# EAGLE design STM32breakout&PowerDistributionIteration4 (EAGLE 9.6.2)
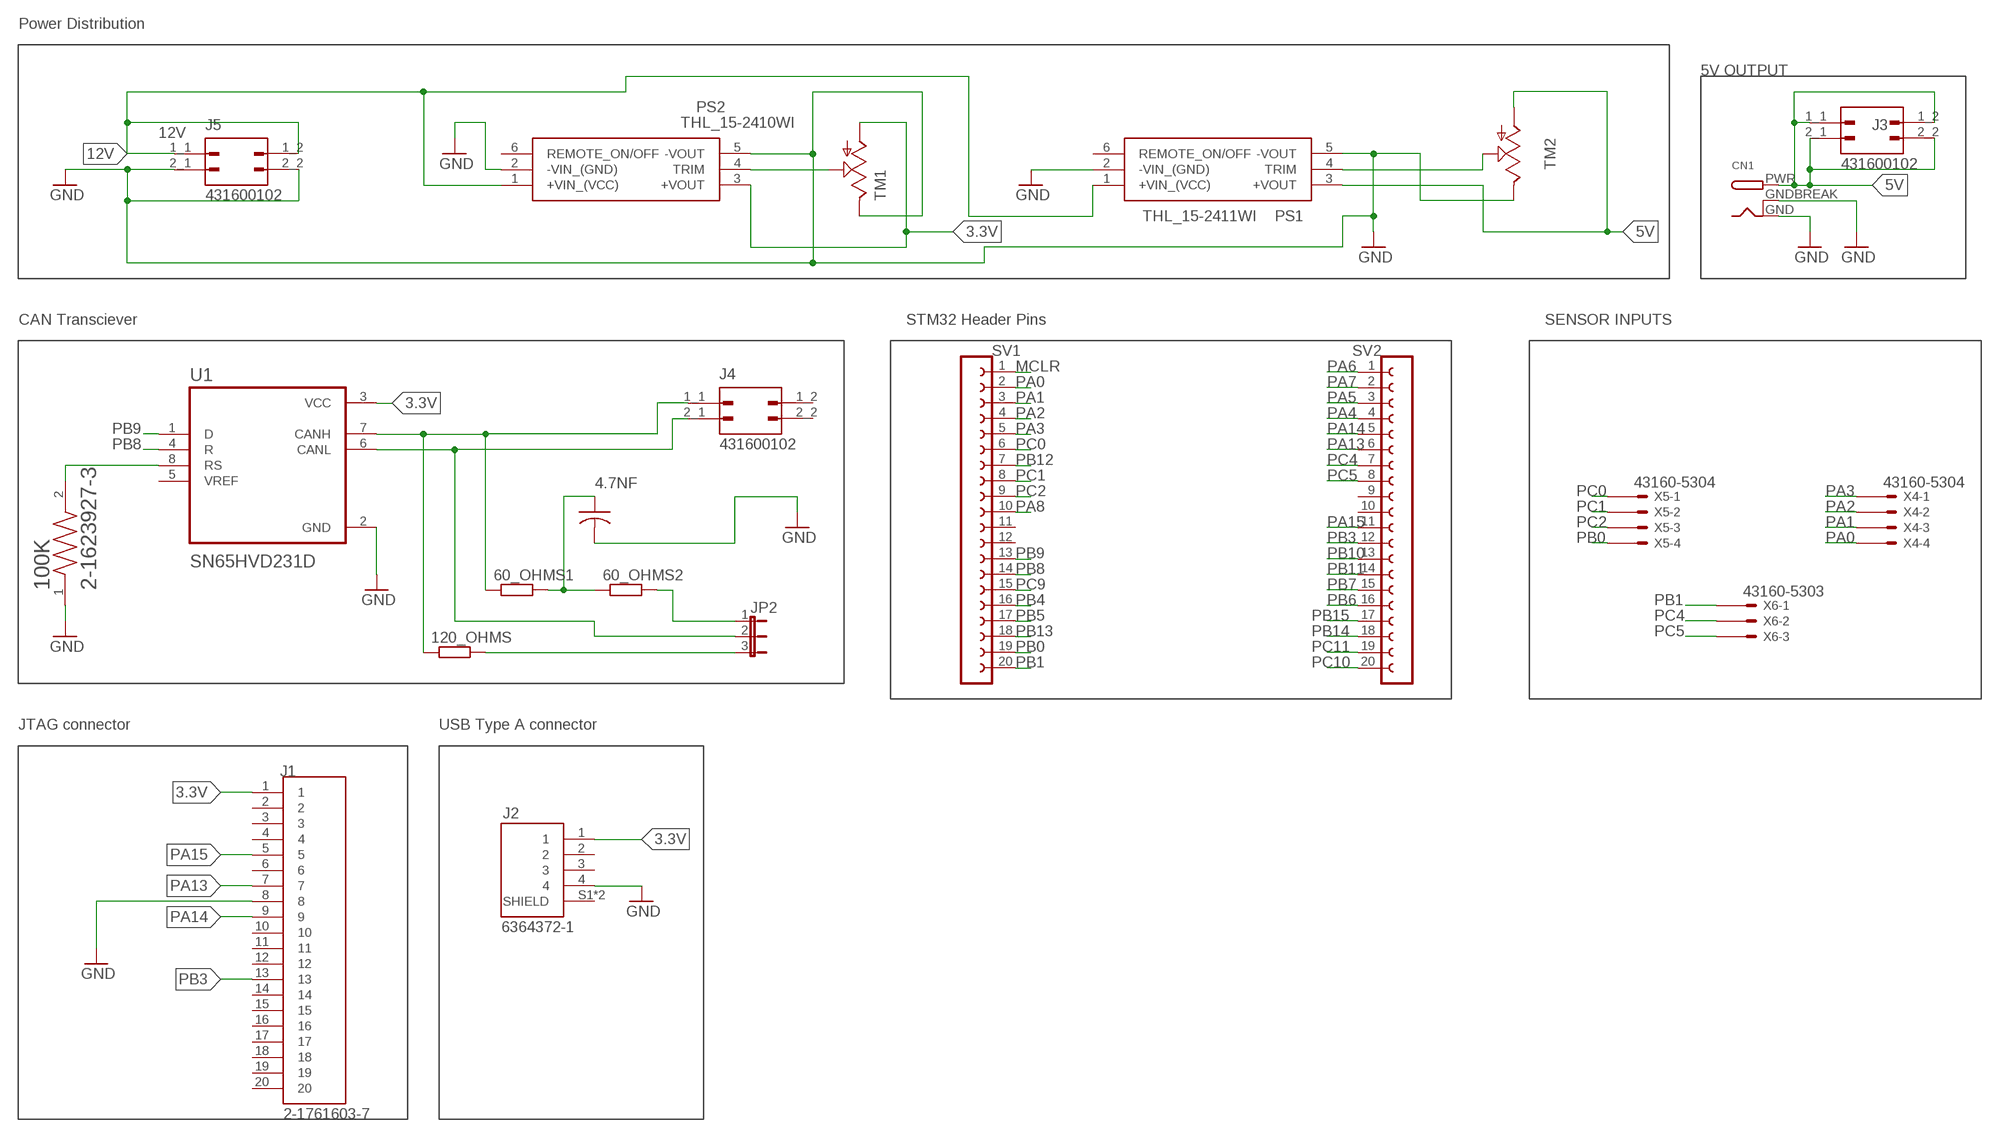
[diagram p0: schematic, sheet 1]

## Parts
4.7NF  C-US025-030X050  [C025-030X050]
60_OHMS1  R-EU_0204/7  [0204/7]
60_OHMS2  R-EU_0204/7  [0204/7]
100K  2-1623927-3  [RESAD700W45L350D185]
120_OHMS  R-EU_0204/7  [0204/7]
CN1  DCBARRELPTH  [DCJACK_2MM_PTH]
J1  2-1761603-7  [TE_2-1761603-7]
J2  6364372-1  [TE_6364372-1]
J3  431600102  [MOLEX_431600102]
J4  431600102  [MOLEX_431600102]
J5  431600102  [MOLEX_431600102]
JP2  JP2W  [JP2W]
PS1  THL_15-2411WI  [THL152411WI]
PS2  THL_15-2410WI  [THL152410WI]
SV1  FE20-1  [FE20]
SV2  FE20-1  [FE20]
TM1  TRIM  [6MM]
TM2  TRIM  [6MM]
U1  SN65HVD231D  [SOIC127P599X175-8N]
X4  43160-5304  [43160-XX04]
X5  43160-5304  [43160-XX04]
X6  43160-5303  [43160-XX03]

## Nets
3.3V: J1.1 J2.1 PS2.3(+VOUT) TM1.A U1.3(VCC)
5V: CN1.PWR J3.1_1 J3.1_2 J3.2_1 J3.2_2 PS1.3(+VOUT) TM2.A
12V: J5.1_1 J5.1_2 PS1.1(+VIN_(VCC)) PS2.1(+VIN_(VCC))
GND: 4.7NF.2 100K.1 CN1.GND CN1.GNDBREAK J1.8 J2.4 J5.2_1 J5.2_2 PS1.2(-VIN_(GND)) PS1.5(-VOUT) PS2.2(-VIN_(GND)) PS2.5(-VOUT) TM1.E TM2.E U1.2(GND)
MCLR: SV1.1
N$1: PS2.4(TRIM) TM1.S
N$3: 100K.2 U1.8(RS)
N$4: 120_OHMS.2 JP2.3
N$5: 60_OHMS2.2 JP2.1
N$6: 4.7NF.1 60_OHMS1.2 60_OHMS2.1
N$8: PS1.4(TRIM) TM2.S
PA0: SV1.2 X4.4@1(-4:S)
PA1: SV1.3 X4.3@1(-3:S)
PA2: SV1.4 X4.2@1(-2:S)
PA3: SV1.5 X4.1@1(-1:S)
PA4: SV2.4
PA5: SV2.3
PA6: SV2.1
PA7: SV2.2
PA8: SV1.10
PA13: J1.7 SV2.6
PA14: J1.9 SV2.5
PA15: J1.5 SV2.11
PB0: SV1.19 X5.4@1(-4:S)
PB1: SV1.20 X6.1@1(-1:S)
PB3: J1.13 SV2.12
PB4: SV1.16
PB5: SV1.17
PB6: SV2.16
PB7: SV2.15
PB8 [Differential Signals]: SV1.14 U1.4(R)
PB9 [Differential Signals]: SV1.13 U1.1(D)
PB10: SV2.13
PB11: SV2.14
PB12: SV1.7
PB13: SV1.18
PB14: SV2.18
PB15: SV2.17
PC0: SV1.6 X5.1@1(-1:S)
PC1: SV1.8 X5.2@1(-2:S)
PC2: SV1.9 X5.3@1(-3:S)
PC4: SV2.7 X6.2@1(-2:S)
PC5: SV2.8 X6.3@1(-3:S)
PC9: SV1.15
PC10: SV2.20
PC11: SV2.19
SIG_N [Differential Signals]: J4.2_1 JP2.2 U1.6(CANL)
SIG_P [Differential Signals]: 60_OHMS1.1 120_OHMS.1 J4.1_1 U1.7(CANH)
Unconnected: J1.2 J1.3 J1.4 J1.6 J1.10 J1.11 J1.12 J1.14 J1.15 J1.16 J1.17 J1.18 J1.19 J1.20 J2.2 J2.3 J2.S1(SHIELD) J2.S2(SHIELD) J4.1_2 J4.2_2 PS1.6(REMOTE_ON/OFF) PS2.6(REMOTE_ON/OFF) SV1.11 SV1.12 SV2.9 SV2.10 U1.5(VREF) X4.1@2(-1:S) X4.2@2(-2:S) X4.3@2(-3:S) X4.4@2(-4:S) X5.1@2(-1:S) X5.2@2(-2:S) X5.3@2(-3:S) X5.4@2(-4:S) X6.1@2(-1:S) X6.2@2(-2:S) X6.3@2(-3:S)

## Notes on the sheet
- Power Distribution
- 5V OUTPUT
- CAN Transciever | STM32 Header Pins | SENSOR INPUTS
- JTAG connector | USB Type A connector

## Library data of the parts
4.7NF = adafruit:C-US: CAPACITOR, American symbol
60_OHMS1 60_OHMS2 120_OHMS = rcl:R-EU_: RESISTOR, European symbol; SPICEPREFIX: R
100K = 2-1623927-3:2-1623927-3: CFR16 5% 10K Check availability <https://pricing.snapeda.com/parts/2-1623927-3/TE%20Connectivity/view-part?ref=eda>; AVAILABILITY: In Stock; COMMENT: 2-1623927-3; DESCRIPTION: Carbon Film Resistors - Through Hole 1K Ohm 5% 1/4W Res Carbon Film; EU_ROHS_COMPLIANCE: Compliant; MF: TE Connectivity; MP: 2-1623927-3; PACKAGE: None; PRICE: None; PURCHASE-URL: https://pricing.snapeda.com/search/part/2-1623927-3/?ref=eda
CN1 = adafruit:DCBARREL: 2.0mm DC Barrel Jack DCJACK_2MM_PTH - Through Hole Jack (4UConnector: 05537)
J1 = 2-1761603-7:2-1761603-7: IDC LOW PRO HDR 20P VERT BLACK Check availability <https://pricing.snapeda.com/parts/2-1761603-7/TE%20Connectivity/view-part?ref=eda>; AVAILABILITY: In Stock; COMMENT: 2-1761603-7; DESCRIPTION: AMP-LATCH 20 Position 2.54 mm Dual Row Through-Hole Straight Pin Header; EU_ROHS_COMPLIANCE: Compliant; MF: TE Connectivity; MP: 2-1761603-7; PACKAGE: None; PRICE: None; PURCHASE-URL: https://pricing.snapeda.com/search/part/2-1761603-7/?ref=eda
J2 = 6364372-1:6364372-1: CONN RCPT USB TYPE A PCB R/A Check availability <https://pricing.snapeda.com/parts/6364372-1/TE%20Connectivity/view-part?ref=eda>; AVAILABILITY: In Stock; CENTERLINE_PITCH: 2 mm[.078 in]; COMMENT: 6364372-1; DESCRIPTION: Conn USB RCP 4 POS Solder RA Thru-Hole 4 Terminal 1 Port Box; EU_ROHS_COMPLIANCE: Compliant; MF: TE Connectivity; MP: 6364372-1; NUMBER_OF_POSITIONS: 4; PACKAGE: None; PRICE: None; PRODUCT_TYPE: Connector; PURCHASE-URL: https://pricing.snapeda.com/search/part/6364372-1/?ref=eda
J3-J5 = 431600102:431600102: Check availability <https://pricing.snapeda.com/parts/43160-0102/Molex/view-part?ref=eda>; AVAILABILITY: In Stock; DESCRIPTION: 2 Position Header, Male Blades Connector Solder 0.295 (7.50mm) Through Hole; MF: Molex; MP: 43160-0102; PACKAGE: None; PRICE: None; PURCHASE-URL: https://pricing.snapeda.com/search/part/43160-0102/?ref=eda
JP2 = jumper:JP2W: JUMPER
PS1 = SamacSys_Parts:THL_15-2411WI: 15 Watt DC/DC converter, industrial, 4:1 input, cost efficient design, encapsulated, 1" x 1" metal package Source: Datasheet <https://tracopower.com/thl15wi-datasheet/>; DESCRIPTION: 15 Watt DC/DC converter, industrial, 4:1 input, cost efficient design, encapsulated, 1" x 1" metal package; HEIGHT: 10.66mm; MANUFACTURER_NAME: Traco Power; MANUFACTURER_PART_NUMBER: THL 15-2411WI; MOUSER_PART_NUMBER: 495-THL15-2411WI; MOUSER_PRICE-STOCK: https://www.mouser.co.uk/ProductDetail/TRACO-Power/THL-15-2411WI?qs=vLWxofP3U2zTxW0y6%2FAPOg%3D%3D
PS2 = SamacSys_Parts:THL_15-2410WI: 15 Watt DC/DC converter, industrial, 4:1 input, cost efficient design, encapsulated, 1" x 1" metal package Source: Datasheet <https://tracopower.com/thl15wi-datasheet/>; DESCRIPTION: 15 Watt DC/DC converter, industrial, 4:1 input, cost efficient design, encapsulated, 1" x 1" metal package; HEIGHT: 10.66mm; MANUFACTURER_NAME: Traco Power; MANUFACTURER_PART_NUMBER: THL 15-2410WI; MOUSER_PART_NUMBER: 495-THL15-2410WI; MOUSER_PRICE-STOCK: https://www.mouser.co.uk/ProductDetail/TRACO-Power/THL-15-2410WI/?qs=vLWxofP3U2zUD2qGlvCiuw%3D%3D
SV1 SV2 = con-lsta:FE20-1: FEMALE HEADER; OC_FARNELL: unknown; OC_NEWARK: unknown
TM1 TM2 = adafruit:TRIM
U1 = SN65HVD231D:SN65HVD231D: Check availability <https://pricing.snapeda.com/parts/SN65HVD231D/Texas%20Instruments/view-part?ref=eda>; AVAILABILITY: In Stock; DESCRIPTION: 3.3V CAN Transceiver with Sleep Mode 8-SOIC -40 to 85; MF: Texas Instruments; MP: SN65HVD231D; PACKAGE: SOIC-8 Texas Instruments; PRICE: None; PURCHASE-URL: https://pricing.snapeda.com/search/part/SN65HVD231D/?ref=eda
X4 X5 = con-molex:43160-*04: SDA-43160 Connector Source: http://www.molex.com/pdm_docs/sd/431601306_sd.pdf; MF: MOLEX; MPN: 43160-5304; OC_FARNELL: unknown; OC_NEWARK: 92M1500
X6 = con-molex:43160-*03: SDA-43160 Connector Source: http://www.molex.com/pdm_docs/sd/431601306_sd.pdf; MF: MOLEX; MPN: 43160-5303; OC_FARNELL: unknown; OC_NEWARK: 92M1499

## Board
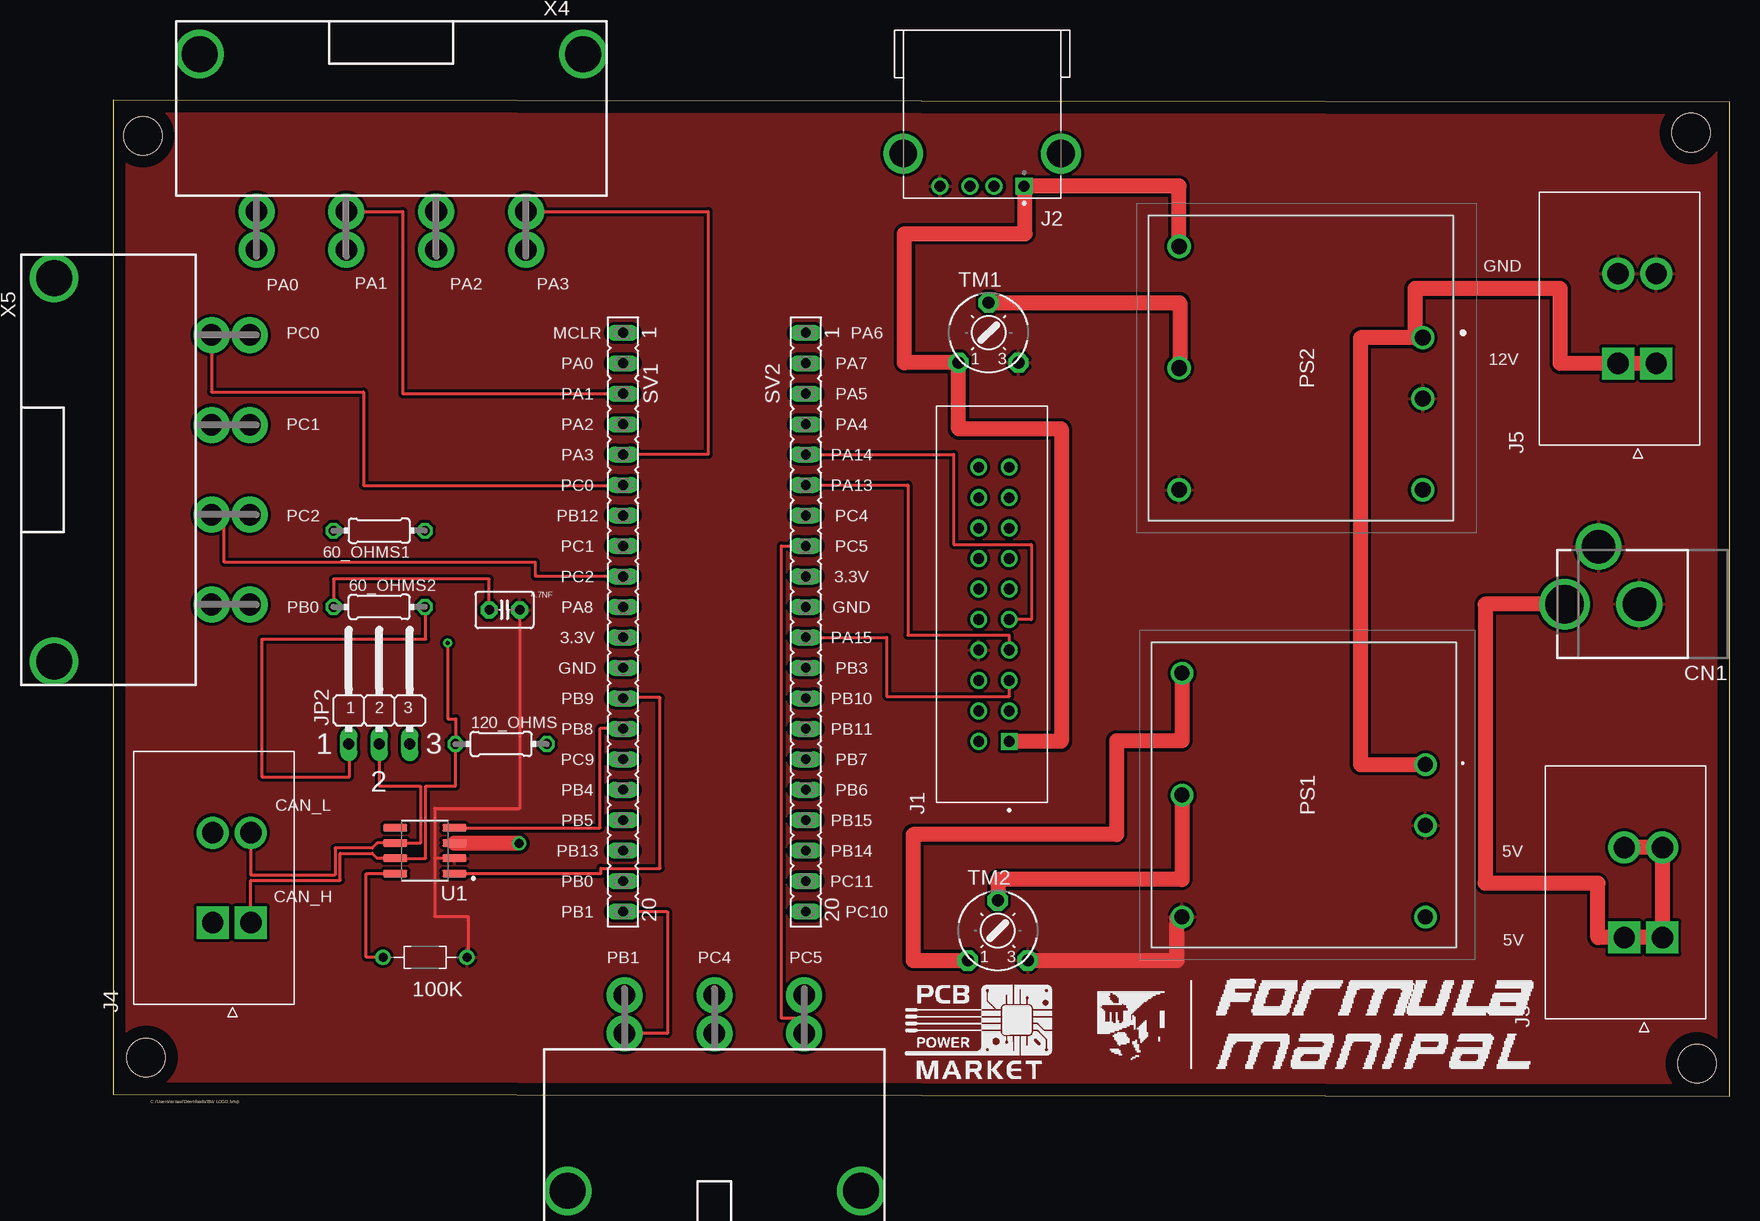
[diagram p1: board, top side]
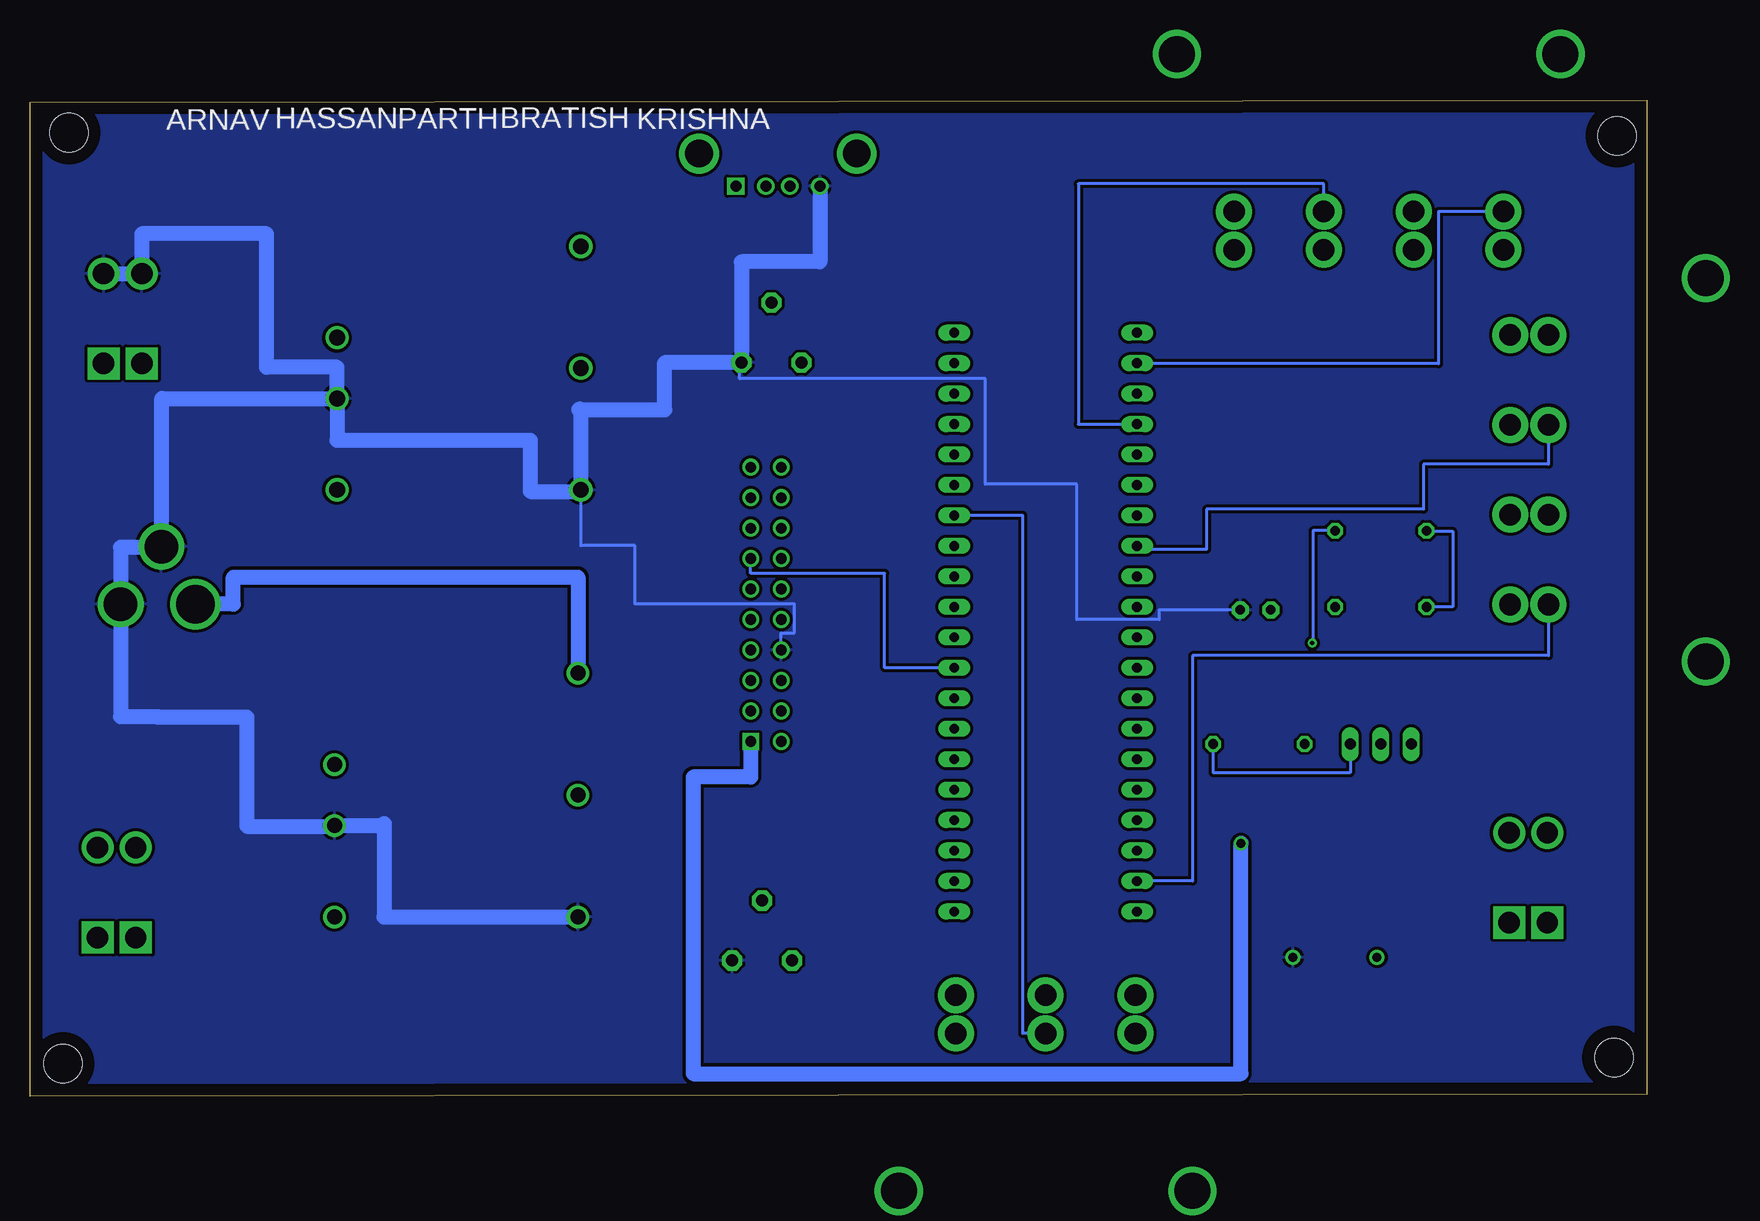
[diagram p2: board, bottom side, seen from below]

Size 134.76 x 83.03 mm. Coordinates in mm from the lower left corner, seen from the top.
Outline: 0,0.16 134.76,0 134.76,82.87 0,83.03 0,0.16
Copper layers (1*16): Top 0.035mm / dielectric 1.5mm / Bottom 0.035mm
Design rules "default *": minimum track width 10mil, minimum drill 0.35mm, track to track 10mil, track to pad 10mil, pad to pad 10mil, via to via 10mil, smd to smd 10mil, copper to edge 40mil, drill to drill 10mil, minimum pad ring 10mil, minimum via ring 8mil, stop-mask expansion 4mil, vias tented up to drill 0mil, thermal gap 10mil
Holes 3.2 mm at 2.48,80.07 2.73,3.24 131.51,80.33 132.02,2.73

### Footprints (pad centres in the part's own frame; a part is rotated, then mirrored left to right if it is on the bottom)
C025-030X050 = drill 0.813 pad 1.422 octagon: 1 -1.27,0; 2 1.27,0
0204/7 = drill 0.813 octagon: 1 -3.81,0; 2 3.81,0
RESAD700W45L350D185 = drill 0.75: 1 -3.5,0; 2 3.5,0
DCJACK_2MM_PTH = drill 2.8: GND 0,7.35; GNDBREAK 4.8,10.75 | drill 3.2: PWR 0,13.6
TE_2-1761603-7 = drill 0.89 pad 1.24 square: 1 0,0 | drill 0.89 pad 1.24: 2 0,2.54; 3 2.54,0; 4 2.54,2.54; 5 5.08,0; 6 5.08,2.54; 7 7.62,0; 8 7.62,2.54; 9 10.16,0; 10 10.16,2.54; 11 12.7,0; 12 12.7,2.54; 13 15.24,0; 14 15.24,2.54; 15 17.78,0; 16 17.78,2.54; 17 20.32,0; 18 20.32,2.54; 19 22.86,0; 20 22.86,2.54
TE_6364372-1 = drill 0.92 square: 1 0,0 | drill 0.92: 2 2.5,0; 3 4.5,0; 4 7,0 | drill 2.3: S1 -3.07,-2.71; S2 10.07,-2.71
MOLEX_431600102 = drill 1.78 pad 2.28 square: 1_1 0,0; 1_2 0,3.18 | drill 1.78 pad 2.28: 2_1 7.493,0; 2_2 7.493,3.18
JP2W = drill 0.914 long: 1 -2.54,-1.27; 2 0,-1.27; 3 2.54,-1.27
THL152411WI = drill 1.25 pad 1.875: 1 0,0; 2 5.08,0; 3 -7.62,-20.3; 4 2.54,-20.3; 5 12.7,-20.3; 6 12.7,0
THL152410WI = drill 1.3 pad 1.95: 1 0,0; 2 -5.08,0; 3 7.62,20.32; 4 -2.54,20.32; 5 -12.7,20.32; 6 -12.7,0
FE20 = drill 0.813 long: 1 -24.13,0; 2 -21.59,0; 3 -19.05,0; 4 -16.51,0; 5 -13.97,0; 6 -11.43,0; 7 -8.89,0; 8 -6.35,0; 9 -3.81,0; 10 -1.27,0; 11 1.27,0; 12 3.81,0; 13 6.35,0; 14 8.89,0; 15 11.43,0; 16 13.97,0; 17 16.51,0; 18 19.05,0; 19 21.59,0; 20 24.13,0
6MM = drill 1 pad 1.676 octagon: A -2.5,-2.5; E 2.5,-2.5; S 0,2.5
SOIC127P599X175-8N = smd 1.97 x 0.6: 1 -2.47,1.905; 2 -2.47,0.635; 3 -2.47,-0.635; 4 -2.47,-1.905; 5 2.47,-1.905; 6 2.47,-0.635; 7 2.47,0.635; 8 2.47,1.905
43160-XX04 = drill 1.8 pad 3: 1@1 -11.235,0; 1@2 -11.235,3.18; 2@1 -3.745,0; 2@2 -3.745,3.18; 3@1 3.745,0; 3@2 3.745,3.18; 4@1 11.235,0; 4@2 11.235,3.18 | drill 3 pad 3.4: M1 -15.985,-13.13; M2 15.985,-13.13
43160-XX03 = drill 1.8 pad 3: 1@1 -7.49,0; 1@2 -7.49,3.18; 2@1 0,0; 2@2 0,3.18; 3@1 7.49,0; 3@2 7.49,3.18 | drill 3 pad 3.4: M1 -12.24,-13.13; M2 12.24,-13.13

### Placement (x,y rotation side)
4.7NF  32.61,40.55 0 top
60_OHMS1  22.16,47.15 180 top
60_OHMS2  22.16,40.8 0 top
100K  25.97,11.59 180 top
120_OHMS  32.32,29.37 0 top
CN1  134.56,41.02 90 top
J1  74.68,29.58 90 top
J2  75.92,75.88 180 top
J3  129.13,13.24 90 top
J4  11.46,14.48 90 top
J5  128.62,61.09 90 top
JP2  22.16,30.64 0 top
PS1  109.38,27.65 270 top
PS2  109.16,63.25 90 top
SV1  42.48,39.53 270 top
SV2  57.72,39.53 270 top
TM1  72.96,63.66 0 top
TM2  73.72,13.81 0 top
U1  25.97,20.48 180 top
X4  23.16,73.76 180 top
X5  8.19,52.23 270 top
X6  50.1,5.24 0 top

### Tracks (layer width: path | path; a pad name or v marks a point on that pad's centre or on a via)
3.3V  (via drill 0.75)
  Top 1.27: J1.1 79.02,29.58 79.02,55.63 70.46,55.63 TM1.A 65.94,61.16 65.94,71.91 76.01,71.91 76.01,75.88 J2.1 88.84,75.88 PS2.3 | v33.81,21.08 28.44,21.08 U1.3
  Bottom 1.27: J1.1 74.68,26.61 79.47,26.61 79.47,1.87 33.81,1.87 v33.81,21.08
5V
  Top 1.27: CN1.PWR 114.35,41.02 114.35,17.76 123.76,17.76 123.76,13.24 J3.1_2 J3.1_1 J3.2_1 J3.2_2 | PS1.3 89.08,29.62 83.63,29.62 83.63,21.81 66.67,21.81 66.67,11.31 TM2.A
  Bottom 1.27: CN1.PWR 117.81,41.02 117.81,43.28 89.08,43.28 PS1.3
12V
  Top 1.27: J5.1_1 J5.1_2 120.6,61.09 120.6,67.34 108.51,67.34 108.51,63.25 PS2.1 103.95,63.25 103.95,27.65 PS1.1
GND
  Top 0.254: U1.2 26.77,19.84 | 26.77,19.84 26.77,14.99 29.59,14.99 29.59,11.71 100K.1 | 26.77,19.84 26.77,24 33.88,24 4.7NF.2
  Top 1.27: TM2.E 88.68,11.31 88.68,14.95 PS1.5
  Bottom 0.254: J1.8 72.14,38.64 71.03,38.64 71.03,41.05 84.33,41.05 84.33,45.91 88.84,45.91 88.84,50.42 | 4.7NF.2 40.65,40.55 40.65,39.73 47.5,39.73 47.5,51.02 55.12,51.02 55.12,59.82 75.6,59.82 75.6,61.16 TM1.E
  Bottom 1.27: J2.4 68.92,69.58 75.46,69.58 TM1.E 81.85,61.16 81.85,57.25 89,57.25 89,57.28 88.84,57.28 PS2.5 88.84,50.42 93.06,50.42 93.06,54.71 109.16,54.71 PS2.2 | PS2.2 123.76,58.17 123.76,45.82 CN1.GNDBREAK 123.81,45.75 127.21,45.75 CN1.GND 127.21,31.65 124.09,31.65 124.09,31.62 116.68,31.62 116.68,22.51 109.38,22.51 PS1.2 105.22,22.57 105.22,22.73 105.25,22.73 105.25,14.95 PS1.5 | J5.2_1 J5.2_2 125.44,71.91 115.03,71.91 115.03,60.77 109.16,60.77 PS2.2
  pour Top: 0.03,82.9 0.03,0.16 134.94,0.16 134.94,82.9
  pour Bottom: 0.13,82.99 0.13,0.16 134.94,0.16 134.94,82.99
N$1
  Top 1.27: TM1.S 88.9,66.16 88.9,60.71 PS2.4
N$3
  Top 0.254: 100K.2 21.08,11.59 21.08,18.57 U1.8
N$4
  Bottom 0.254: JP2.3 24.7,26.96 36.13,26.96 120_OHMS.2
N$5
  Top 0.254: 60_OHMS2.2 26.04,40.8 26.04,38.1 12.38,38.1 12.38,26.64 19.68,26.64 19.68,29.37 JP2.1
N$6
  Top 0.254: 4.7NF.1 31.34,43.12 18.35,43.12 60_OHMS2.1
  Bottom 0.254: 60_OHMS1.2 18.35,47.12 16.16,47.12 16.16,40.8 60_OHMS2.1
N$8
  Top 1.27: PS1.4 89.08,18.07 73.72,18.07 TM2.S
PA0
  Bottom 0.254: X4.4@1 17.36,73.76 17.36,61.08 43.43,61.08 43.43,61.12 SV1.2
PA1
  Top 0.254: X4.3@1 24.12,73.76 24.12,58.57 42.48,58.57 SV1.3
PA2
  Bottom 0.254: X4.2@1 26.91,76.07 47.38,76.07 47.38,56.04 SV1.4
PA3
  Top 0.254: X4.1@1 49.59,73.76 49.59,53.5 SV1.5
PA13
  Top 0.254: SV2.6 66.23,50.96 66.23,38.45 74.68,38.45 J1.7
PA14
  Top 0.254: SV2.5 70.05,53.5 70.05,46.01 76.52,46.01 76.52,39.74 J1.9
PA15
  Top 0.254: SV2.11 64.45,38.26 64.45,33.34 74.71,33.34 74.71,34.66 J1.5
PB0
  Bottom 0.254: SV1.19 37.85,17.94 37.85,36.73 8.19,36.73 X5.4@1
PB1
  Top 0.254: SV1.20 46.19,15.4 46.19,5.24 X6.1@1
PB3
  Bottom 0.254: SV2.12 63.53,35.72 63.53,43.59 74.68,43.59 J1.13
PB8
  Top 0.254: SV1.14 42.48,30.69 40.59,30.69 40.59,22.38 U1.4
PB9
  Top 0.254: U1.1 40.65,18.57 40.65,19.01 45.58,19.01 45.58,33.23 42.48,33.23 SV1.13
PC0
  Top 0.254: SV1.6 42.48,50.92 20.85,50.92 20.85,58.71 8.19,58.71 X5.1@1
PC1
  Bottom 0.254: X5.2@1 8.19,52.7 18.61,52.7 18.61,48.95 36.68,48.95 36.68,45.59 42.48,45.59 SV1.8
PC2
  Top 0.254: X5.3@1 9.25,48.48 9.25,44.51 35.18,44.51 35.18,43.34 SV1.9
PC4
  Bottom 0.254: X6.2@1 52.01,5.24 52.01,48.42 SV2.7
PC5
  Top 0.254: X6.3@1 57.59,6.51 55.69,6.51 55.69,45.88 SV2.8
SIG_N
  Top 0.254: JP2.2 22.16,25.86 25.62,25.86 25.62,21.11 U1.6 22.01,21.11 21.59,20.69 18.48,20.69 18.48,18.44 11.46,18.44 J4.2_1
SIG_P  (via drill 0.35)
  Top 0.254: 28.52,29.37 28.52,25.86 26.05,25.86 26.05,19.84 U1.7 22.01,19.84 21.59,20.26 18.91,20.26 18.91,18.01 11.46,18.01 J4.1_1 | 28.52,29.37 120_OHMS.1 | v27.88,37.78 27.88,31.46 28.54,31.46 28.54,29.37 28.52,29.37
  Bottom 0.254: 60_OHMS1.1 27.81,47.15 27.81,37.75 27.88,37.75 v27.88,37.78

### Text on the board
tPlace: C:/FORMULAMANIPAL/PCB designs/Logo/pcbpowerlogo1.bmp | C:/Users/arnav/Downloads/BW LOGO.bmp
bPlace: KRISHNA | BRATISH | PARTH | HASSAN | ARNAV
tNames: GND | PA0 | PA1 | PA2 | PA3 | PC0 | MCLR | PA6 | PA0 | PA7 | 12V | PA1 | PA5 | PC1 | PA2 | PA4 | PA3 | PA14 | PC0 | PA13 | PC2 | PB12 | PC4 | PC1 | PC5 | PC2 | 3.3V | PB0 | PA8 | GND | 3.3V | PA15 | GND | PB3 | PB9 | PB10 | PB8 | PB11 | 1 | 3 | PC9 | PB7 | 2 | PB4 | PB6 | CAN_L | PB5 | PB15 | PB13 | PB14 | 5V | PB0 | PC11 | CAN_H | PB1 | PC10 | 5V | PB1 | PC4 | PC5